# EAGLE design pam2803-boost-driver-17mm-mk-1.1 (EAGLE 6.6.0)
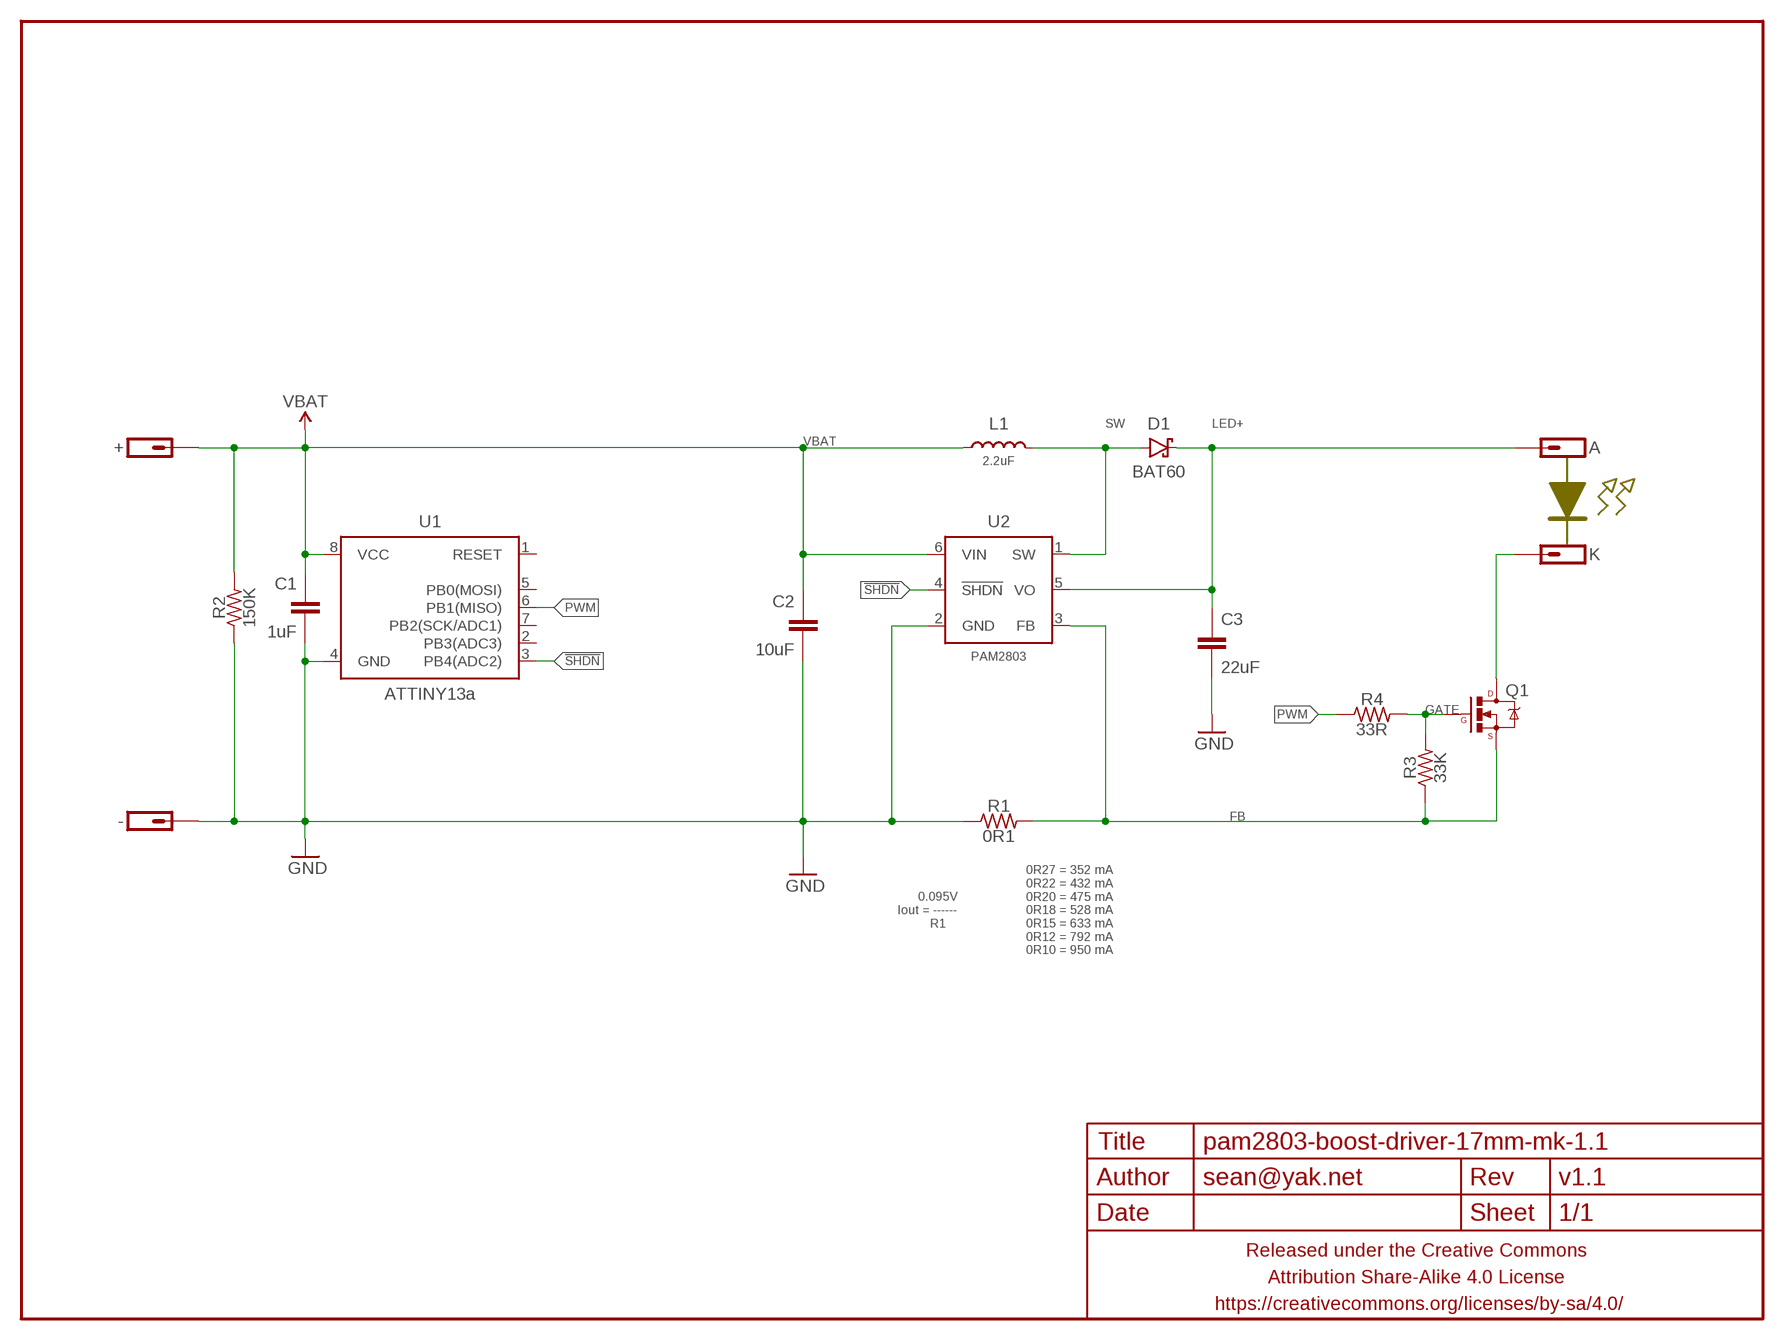
[diagram p0: schematic, sheet 1]

## Parts
+  M01PTH-1MM-CIR-NS  [1X01-1MM-CIR-NS]
-  M01NOT-A-VIA-NOPE  [1X01_NOSILK_NOSTOP]
A  M01PTH-1MM-CIR-NS  [1X01-1MM-CIR-NS]
C1  1uF  CAPACITOR-CERAMICC0402  [C0402]
C2  10uF  CAPACITOR-CERAMICC0805-TIGHTER  [C0805-TIGHTER]
C3  22uF  CAPACITOR-CERAMICC0805-TIGHTER  [C0805-TIGHTER]
D1  BAT60  DIODE-SCHOTTKYSOD323  [SOD323-SCHOTTKY]
FRAME1  FRAME-LETTERNO_PACKAGE  [DUMMY]
K  M01PTH-1MM-CIR-NS  [1X01-1MM-CIR-NS]
L1  2.2uF  INDUCTORXFL4020  [XFL4020]
Q1  MOSFET-NCHANNELIRLML2502  [SOT23]
R1  0R1  RESISTORR0805-TIGHTER  [R0805-TIGHTER]
R2  150K  RESISTORR0603-TIGHTER  [R0603-TIGHTER]
R3  33K  RESISTORR0603-TIGHTER  [R0603-TIGHTER]
R4  33R  RESISTORR0603-TIGHTER  [R0603-TIGHTER]
U1  ATTINY13a  ATTINY13SOIC-NARROWER  [SO08-SKINNYPADS]
U2  PAM2803  PAM2803SOT23-6  [SOT23-6]

## Nets
!SHDN: U1.3(PB4(ADC2)) U2.4(!SHDN)
FB: Q1.2(S) R1.2 R3.1 U2.3(FB)
GATE: Q1.1(G) R3.2 R4.2
GND: -.P$1 C1.2 C2.2 C3.2 R1.1 R2.1 U1.4(GND) U2.2(GND)
LED+: A.1 C3.1 D1.C U2.5(VO)
LED-: K.1 Q1.3(D)
PWM: R4.1 U1.6(PB1(MISO))
SW: D1.A L1.P$1 U2.1(SW)
VBAT: +.1 C1.1 C2.1 L1.P$2 R2.2 U1.8(VCC) U2.6(VIN)
Unconnected: U1.1(RESET) U1.2(PB3(ADC3)) U1.5(PB0(MOSI)) U1.7(PB2(SCK/ADC1))

## Notes on the sheet
- 0.095V
  Iout = ------
        R1
- 0R27 = 352 mA
  0R22 = 432 mA
  0R20 = 475 mA
  0R18 = 528 mA
  0R15 = 633 mA
  0R12 = 792 mA
  0R10 = 950 mA

## Library data of the parts
+ - A K = a_parts:M01: Header 1 Standard 1-pin 0.1" header. Use with straight break away headers (SKU : PRT-00116), right angle break away headers (PRT-00553), swiss pins (PRT-00743), machine pins (PRT-00117), and female headers (PRT-00115).
C1-C3 = a_parts:CAPACITOR-CERAMIC: CAPACITOR, European symbol
D1 = a_parts:DIODE-SCHOTTKY: Schottky diodes in SFE's production catalog BAT20J 1A 23V 0.62Vf RB751 120mA 40V 0.37Vf PMEG4005EJ 0.5A 40V 0.42Vf MBRA140 1A 40V 0.5Vf B340A 3A 40V SMA
FRAME1 = a_parts:FRAME-LETTER: Schematic Frame Standard 8.5x11 US Letter frame; DESIGNER: sean@yak.net; VERSION: v1.1
L1 = a_parts:INDUCTOR: Inductors Basic Inductor/Choke - 0603 and 1206. Footprints are not proven and vary greatly between part numbers. SRN6045- 33uH, 20% 1.4A SDR0403-560KL - 56uH, 10%, 500mA RMS/740mA peak
Q1 = a_parts:MOSFET-NCHANNEL: Common NMOSFET Parts MFG P/N Store ID Prod ID FDD8780 TRANS-09984 SI7820DN TRANS-11055 FDS6630A IC-08089 2N7002PW TRANS-11151 FQP30N06L COM-10213 TRANS-10060 BSS123LT1G TRANS-08345 BSS138 TRANS-00830 BS170 2N7000
R1-R4 = a_parts:RESISTOR: RESISTOR, American symbol
U1 = a_parts:ATTINY13: Atmel 8-pin 1kB flash uC
U2 = a_parts:PAM2803

## Board
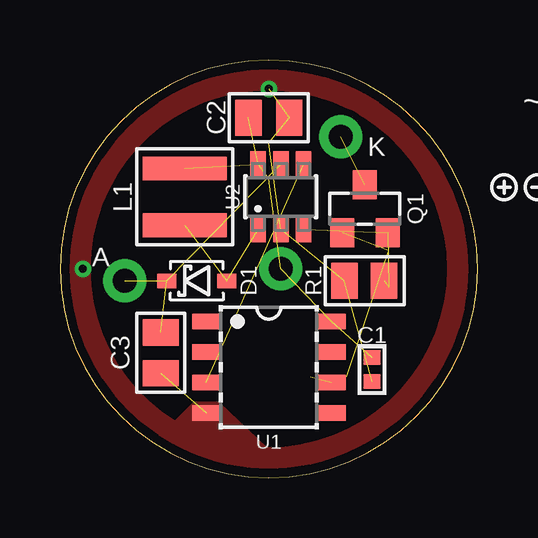
[diagram p1: board, top side]
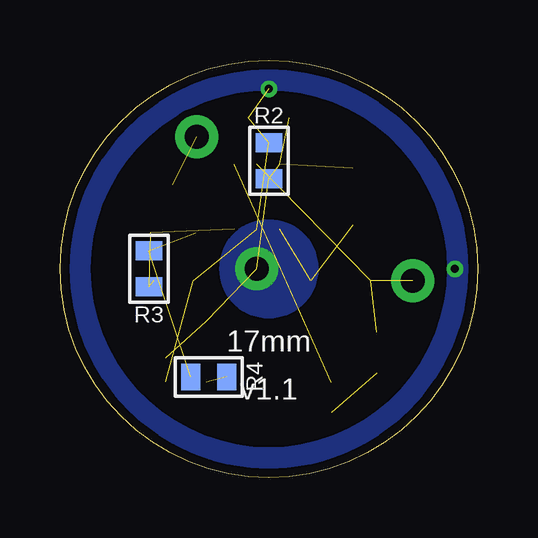
[diagram p2: board, bottom side, seen from below]

Size 17.4 x 17.4 mm. Coordinates in mm from the lower left corner, seen from the top.
Outline: 0,8.7 arc180 17.4,8.7 arc180 0,8.7
Copper layers (1*16): Top 0.0356mm / dielectric 1.5011mm / Bottom 0.0356mm
Design rules "LaenPCBOrder2": minimum track width 6mil, minimum drill 13mil, track to track 6mil, track to pad 6mil, pad to pad 6mil, via to via 6mil, smd to smd 6mil, copper to edge 15mil, drill to drill 6mil, minimum pad ring 7mil, minimum via ring 7mil, stop-mask expansion 3mil, vias tented up to drill 20mil, thermal gap 10mil

### Footprints (pad centres in the part's own frame; a part is rotated, then mirrored left to right if it is on the bottom)
1X01-1MM-CIR-NS = drill 1.016 pad 1.778: 1 0,0
1X01_NOSILK_NOSTOP = drill 0.33: P$1 0,0
C0402 = smd 0.6 x 0.7: 1 -0.5,0; 2 0.5,0
C0805-TIGHTER = smd 1.1 x 1.5: 1 -0.85,0; 2 0.85,0
SOD323-SCHOTTKY = smd 0.8 x 0.6: A -1.25,0; C 1.25,0
XFL4020 = smd 0.98 x 3.5: P$1 -1.185,0; P$2 1.185,0
SOT23 = smd 1 x 1.2: 1 -0.95,-1; 2 0.95,-1; 3 0,1
R0805-TIGHTER = smd 1.1 x 1.5: 1 -0.85,0; 2 0.8,0
R0603-TIGHTER = smd 0.8 x 1.1: 1 -0.75,0; 2 0.75,0
SO08-SKINNYPADS = smd 0.65 x 1.2: 1 -1.905,-2.6; 2 -0.635,-2.6; 3 0.635,-2.6; 4 1.905,-2.6; 5 1.905,2.6; 6 0.635,2.6; 7 -0.635,2.6; 8 -1.905,2.6
SOT23-6 = smd 0.65 x 1.1: 1 -0.95,-1.35; 2 0,-1.35; 3 0.95,-1.35; 4 0.95,1.35; 5 0,1.35; 6 -0.95,1.35

### Placement (x,y rotation side)
+  9.2,8.7 0 top
-  0.95,8.7 90 top
A  2.7,8.2 180 top
C1  13,4.5 270 top
C2  8.7,15 0 top
C3  4.2,5.2 270 top
D1  5.7,8.2 180 top
FRAME1  0.2,0.2 0 top
K  11.7,14.2 0 top
L1  5.2,11.7 90 top
Q1  12.7,11.2 0 top
R1  12.7,8.2 0 top
R2  8.7,13.2 270 bottom
R3  13.7,8.7 90 bottom
R4  11.2,4.2 180 bottom
U1  8.7,4.6 270 top
U2  9.2,11.7 0 top

### Tracks (layer width: path | path; a pad name or v marks a point on that pad's centre or on a via)
!SHDN  (1 unrouted)
FB  (3 unrouted)
GATE  (2 unrouted)
GND  (via drill 0.33)  (6 unrouted)
  other vias: 8.7,16.2
  pour Bottom (isolate 0.305, rank 6, no thermals): 0.2,8.7 arc-90 8.7,17.2 arc-90 17.2,8.7 16.2,8.7 arc90 8.7,16.2 arc90 1.2,8.7
  pour Bottom (isolate 0.305, rank 6, no thermals): 17.2,8.7 arc-90 8.7,0.2 arc-90 0.2,8.7 1.2,8.7 arc90 8.7,1.2 arc90 16.2,8.7
  pour Top (isolate 0.305, rank 6, no thermals): 0.2,8.7 arc-90 8.7,17.2 arc-90 17.2,8.7 16.2,8.7 arc90 8.7,16.2 arc90 1.2,8.7
  pour Top (isolate 0.305, rank 6, no thermals): 17.2,8.7 arc-90 8.7,0.2 arc-90 0.2,8.7 1.2,8.7 arc90 8.7,1.2 arc90 16.2,8.7
  pour Top (rank 2, no thermals): 5.6,3.1 6.6,3.1 8.6,1.2 8.7,1.1 8.7,0.7 7.7,0.7 4.7,2.2
LED+  (3 unrouted)
LED-  (1 unrouted)
PWM  (1 unrouted)
SW  (2 unrouted)
VBAT  (6 unrouted)
  pour Bottom (rank 2, no thermals): 6.7,8.7 arc-90 8.7,10.7 arc-90 10.7,8.7 arc-90 8.7,6.7 arc-90

### Text on the board
bPlace: PAM2803 | Boost Driver | 17mm
tNames: ~